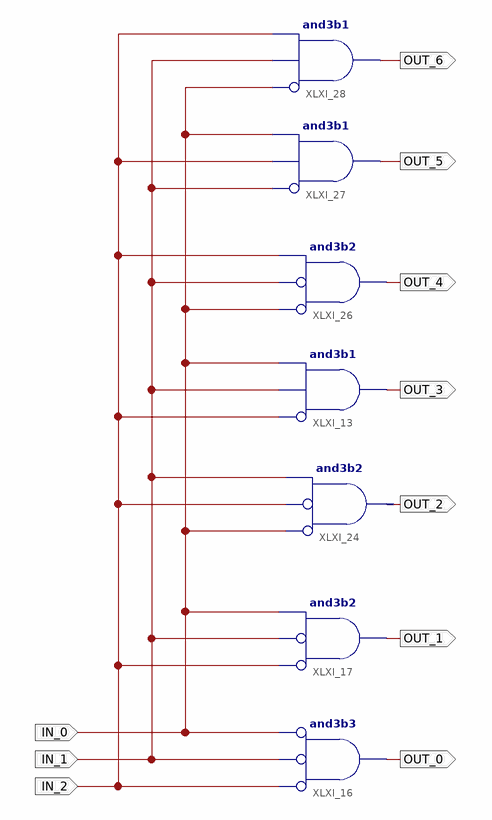
[diagram p0: schematic sheet 1]
// Xilinx ISE schematic My3To7Decoder.sch (spartan3a) as structural Verilog: 7 symbols, 10 ports
module My3To7Decoder (
  input  IN_1,
  input  IN_0,
  input  IN_2,
  output OUT_5,
  output OUT_4,
  output OUT_3,
  output OUT_2,
  output OUT_1,
  output OUT_0,
  output OUT_6
);

  and XLXI_13 (OUT_3, ~IN_2, IN_1, IN_0);  // and3b1
  and XLXI_16 (OUT_0, ~IN_2, ~IN_1, ~IN_0);  // and3b3
  and XLXI_17 (OUT_1, ~IN_2, ~IN_1, IN_0);  // and3b2
  and XLXI_24 (OUT_2, ~IN_0, ~IN_2, IN_1);  // and3b2
  and XLXI_26 (OUT_4, ~IN_0, ~IN_1, IN_2);  // and3b2
  and XLXI_27 (OUT_5, ~IN_1, IN_2, IN_0);  // and3b1
  and XLXI_28 (OUT_6, ~IN_0, IN_1, IN_2);  // and3b1
endmodule
